# EAGLE design Clock-v16 (EAGLE 5.10)
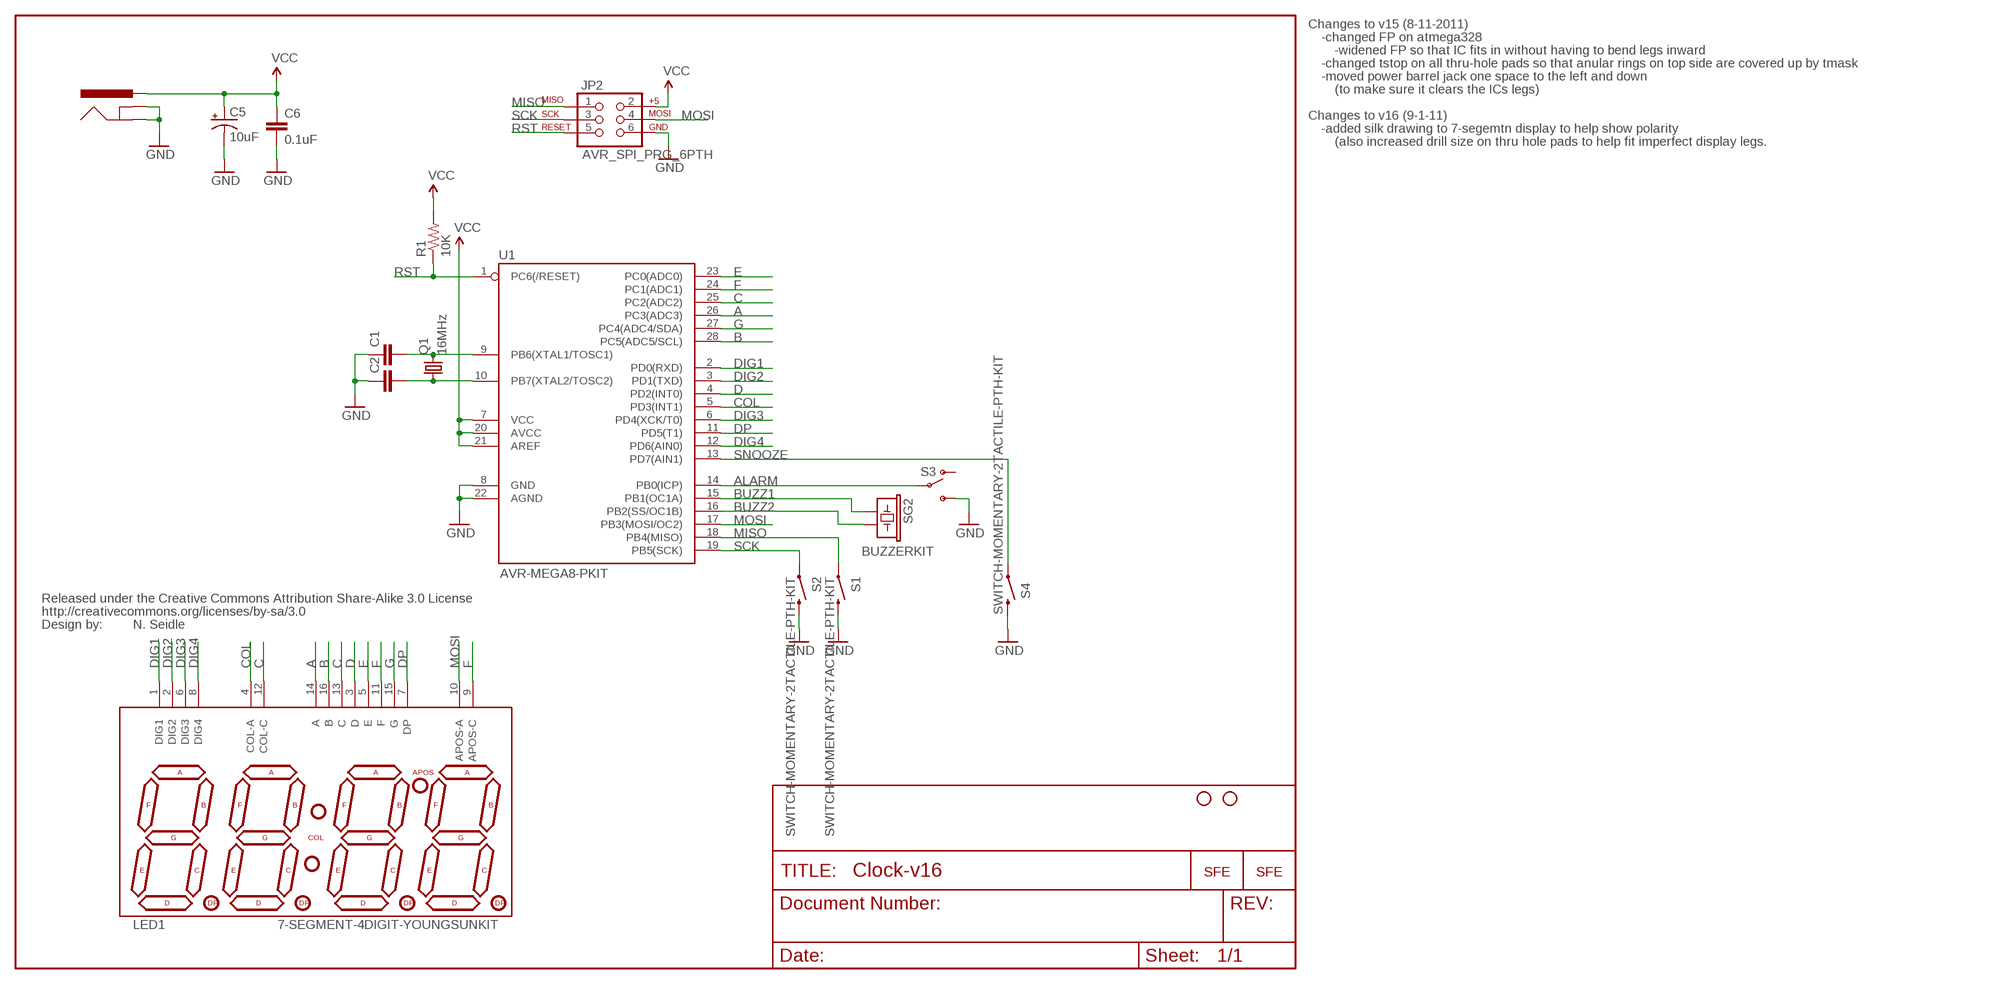
[diagram p0: schematic, sheet 1]

## Parts
C1  CAPCAP-PTH-SMALL-KIT  [CAP-PTH-SMALL-KIT]
C2  CAPCAP-PTH-SMALL-KIT  [CAP-PTH-SMALL-KIT]
C5  10uF  CAP_POLCPOL-RADIAL-10UF-25V-KIT  [CPOL-RADIAL-10UF-25V-KIT]
C6  0.1uF  CAPCAP-PTH-SMALL-KIT  [CAP-PTH-SMALL-KIT]
J1  POWER_JACKKIT  [POWER-BARRELJACK-PTH-LOCK-KIT]
JP2  AVR_SPI_PRG_6PTH  [2X3]
LED1  7-SEGMENT-4DIGIT-YOUNGSUNKIT  [7-SEGMENT-4DIGIT-YOUNGSUN-KIT]
Q1  16MHz  CRYSTALHC49US-KIT  [HC49US-KIT]
R1  10K  RESISTORAXIAL-0.3-KIT  [AXIAL-0.3-KIT]
S1  SWITCH-MOMENTARY-2TACTILE-PTH-KIT  [TACTILE-PTH-KIT]
S2  SWITCH-MOMENTARY-2TACTILE-PTH-KIT  [TACTILE-PTH-KIT]
S3  SWITCH-SPSTKIT  [SWITCH-SPDT_KIT]
S4  SWITCH-MOMENTARY-2TACTILE-PTH-KIT  [TACTILE-PTH-KIT]
SG2  BUZZERKIT  [BUZZER-12MM-KIT]
U1  AVR-MEGA8-PKIT  [DIL28-3-KIT]
U$1  LOGO-SFESK  [SFE-LOGO-FLAME]
U$2  CREATIVE_COMMONS  [CREATIVE_COMMONS]
U$3  LOGO-SFENEW  [SFE-NEW-WEBLOGO]
U$8  STAND-OFF  [STAND-OFF]
U$9  STAND-OFF  [STAND-OFF]

## Nets
A: LED1.14(A) U1.26(PC3(ADC3))
ALARM: S3.2(P) U1.14(PB0(ICP))
B: LED1.16(B) U1.28(PC5(ADC5/SCL))
BUZZ1: SG2.+ U1.15(PB1(OC1A))
BUZZ2: SG2.- U1.16(PB2(SS/OC1B))
C: LED1.12(COL-C) LED1.13(C) U1.25(PC2(ADC2))
COL: LED1.4(COL-A) U1.5(PD3(INT1))
D: LED1.3(D) U1.4(PD2(INT0))
DIG1: LED1.1(DIG1) U1.2(PD0(RXD))
DIG2: LED1.2(DIG2) U1.3(PD1(TXD))
DIG3: LED1.6(DIG3) U1.6(PD4(XCK/T0))
DIG4: LED1.8(DIG4) U1.12(PD6(AIN0))
DP: LED1.7(DP) U1.11(PD5(T1))
E: LED1.5(E) U1.23(PC0(ADC0))
F: LED1.9(APOS-C) LED1.11(F) U1.24(PC1(ADC1))
G: LED1.15(G) U1.27(PC4(ADC4/SDA))
GND: C1.1 C2.1 C5.2(-) C6.2 J1.GND J1.GNDBREAK JP2.6 S1.3 S2.3 S3.3(S) S4.3 U1.8(GND) U1.22(AGND)
MISO: JP2.1 S1.1 U1.18(PB4(MISO))
MOSI: JP2.4 LED1.10(APOS-A) U1.17(PB3(MOSI/OC2))
N$1: C1.2 Q1.2 U1.9(PB6(XTAL1/TOSC1))
N$2: C2.2 Q1.1 U1.10(PB7(XTAL2/TOSC2))
RST: JP2.5 R1.P$1 U1.1(PC6(/RESET))
SCK: JP2.3 S2.1 U1.19(PB5(SCK))
SNOOZE: S4.1 U1.13(PD7(AIN1))
VCC: C5.1(+) C6.1 J1.PWR JP2.2 R1.P$2 U1.7(VCC) U1.20(AVCC) U1.21(AREF)
Unconnected: S3.1(O)

## Notes on the sheet
- Changes to v15 (8-11-2011)
- -changed FP on atmega328
- -widened FP so that IC fits in without having to bend legs inward
- -changed tstop on all thru-hole pads so that anular rings on top side are covered up by tmask
- -moved power barrel jack one space to the left and down
- (to make sure it clears the ICs legs)
- Changes to v16 (9-1-11)
- -added silk drawing to 7-segemtn display to help show polarity
- (also increased drill size on thru hole pads to help fit imperfect display legs.
- N. Seidle

## Library data of the parts
C1 C2 C6 = SparkFun:CAP: Capacitor Standard 0603 ceramic capacitor, and 0.1" leaded capacitor.
C5 = Testing:CAP_POL: Capacitor Polarized These are standard SMD and PTH capacitors. Normally 10uF, 47uF, and 100uF in electrolytic and tantalum varieties. Always verify the external diameter of the through hole cap, it varies with capacity, voltage, and manufacturer. The EIA devices should be standard.
J1 = Testing:POWER_JACK: Power Jack This is the standard 5.5mm barrel jack for power. The PTH is the most common, proven, reliable, footprint. All others are experimental. The Slot footprint only works if the mill layer is transmitted to the PCB fab house so be warned. Spark Fun Electronics SKU : PRT-00119. Mating wall wart : TOL-00298 (and others)
JP2 = SparkFun:AVR_SPI_PRG_6: AVR ISP 6 Pin This is the reduced ISP connector for AVR programming. Common on Arduino. This footprint will take up less PCB space and can be used with a 10-pin to 6-pin adapter such as SKU: BOB-08508
LED1 = Testing:7-SEGMENT-4DIGIT-YOUNGSUN: This is a part for the 4-Digit 7-segment LEDs from Young Sun. Different from the Digikey LEDs, all 16 pins are used. The LONGPADS Variant is used for a test jig, but you may like it because there is more pad to solder to. If you are concerned about routing space, the standard works just fine though.
Q1 = Testing:CRYSTAL: Crystals Various standard crystals. Proven footprints. Spark Fun Electronics SKU : COM-00534
R1 = SparkFun:RESISTOR: Resistor Basic schematic elements and footprints for 0603, 1206, and PTH resistors.
S1 S2 S4 = Testing:SWITCH-MOMENTARY-2
S3 = SparkFun:SWITCH-SPST: SPST Switch Simple slide switch. Spark Fun Electronics SKU : COM-00102
SG2 = SparkFun:BUZZER: Buzzer 12mm Spark Fun Electronics SKU : Comp-Buzzer
U1 = Testing:AVR-MEGA8-P: MICROCONTROLLER 8 Kbytes FLASH 1 kbytes SRAM 512 bytes EEPROM USART 4-channel 10 bit ADC 2-channel 8 bit ADC
U$1 U$3 = SparkFun:LOGO-SFE: Spark Fun Electronics PCB Logo This is the standard Spark Fun Electronics PCB logo.
U$2 = SparkFun:CREATIVE_COMMONS
U$8 U$9 = SparkFun:STAND-OFF: Stand Off This is the mechanical footprint for a #4 phillips button head screw. Use the keepout ring to avoid running the screw head into surrounding components. SKU : PRT-00447

## Board
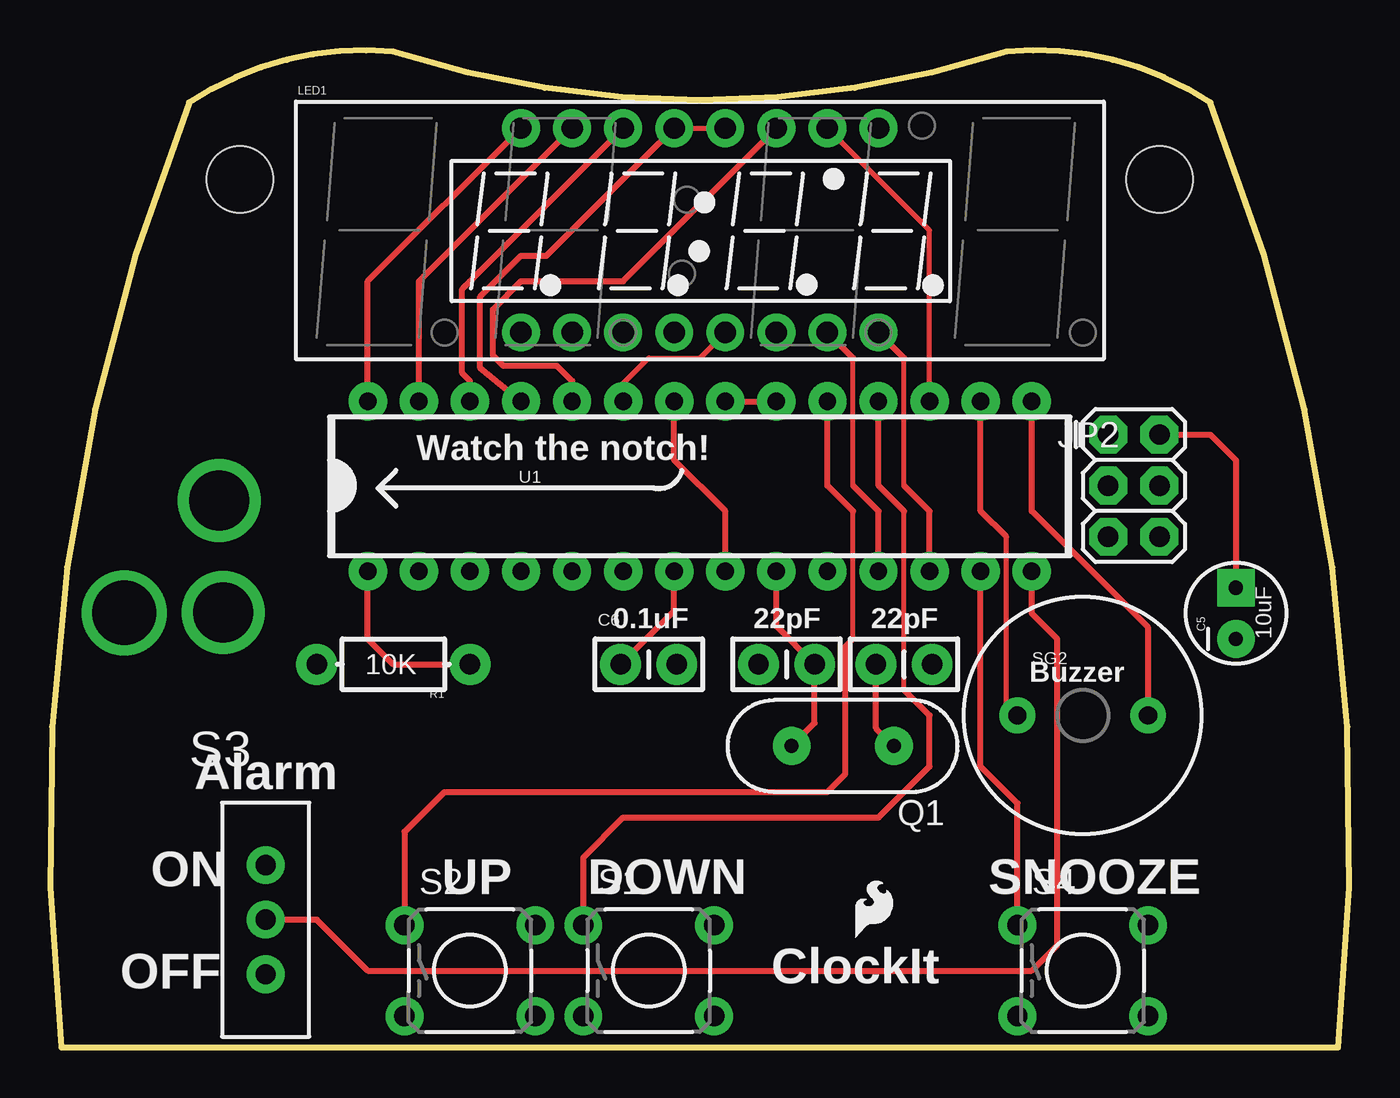
[diagram p1: board, top side]
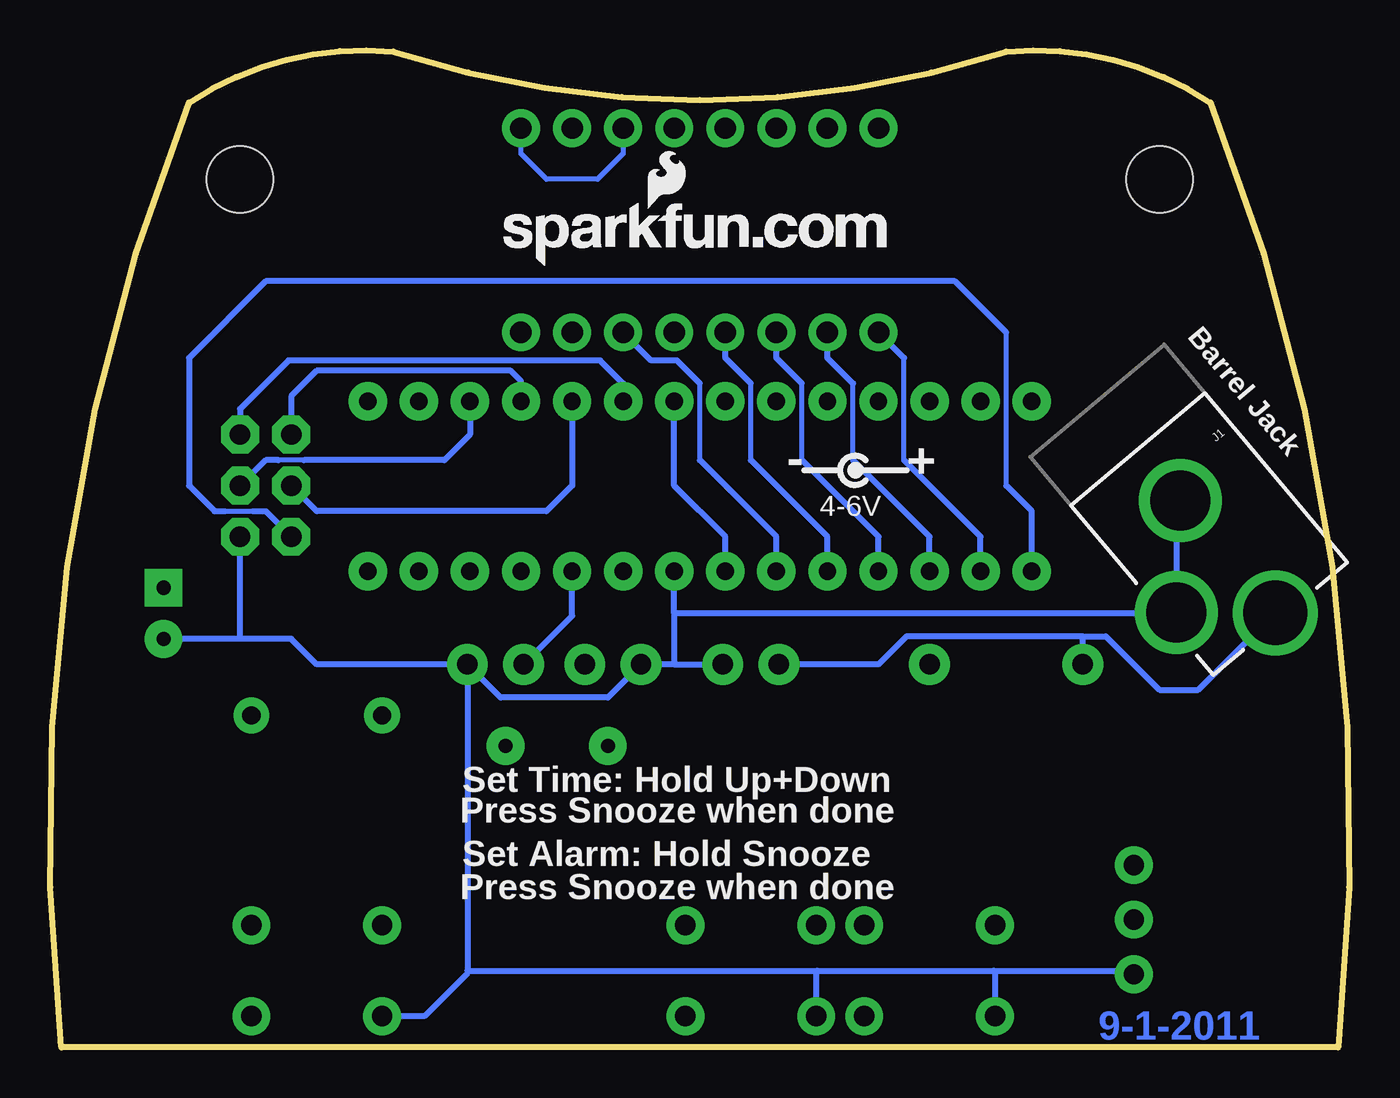
[diagram p2: board, bottom side, seen from below]

Size 64.61 x 49.6 mm. Coordinates in mm from the lower left corner, seen from the top.
Outline: 6.9,46.99 arc28 0.55,0 64.05,0 arc28 57.7,46.99 arc38 47.54,49.53 arc-36 17.06,49.53 arc39 6.9,46.99
Copper layers (1*16): Top 0.035mm / dielectric 1.5mm / Bottom 0.035mm
Design rules "SparkFun": minimum track width 8mil, minimum drill 20mil, track to track 8mil, track to pad 8mil, pad to pad 8mil, via to via 8mil, smd to smd 8mil, copper to edge 10mil, drill to drill 8mil, minimum pad ring 12mil, minimum via ring 10mil, stop-mask expansion 4mil, vias tented up to drill 25mil, thermal gap 10mil

### Footprints (pad centres in the part's own frame; a part is rotated, then mirrored left to right if it is on the bottom)
CAP-PTH-SMALL-KIT = drill 1.016 pad 2.032 round: 1 -0.127,0; 2 2.667,0
CPOL-RADIAL-10UF-25V-KIT = drill 0.7 pad 1.88 square: 1 1.27,0 | drill 0.7 pad 1.88 round: 2 -1.27,0
POWER-BARRELJACK-PTH-LOCK-KIT = drill 2.997 pad 4.115 round: GND 0.025,6.557; GNDBREAK 3.762,10.7 | drill 3.2 pad 4.115 round: PWR 0,13.878
2X3 = drill 1.016 pad 1.88 octagon: 1 0,0; 2 0,2.54; 3 2.54,0; 4 2.54,2.54; 5 5.08,0; 6 5.08,2.54
7-SEGMENT-4DIGIT-YOUNGSUN-KIT = drill 1.067 pad 1.88 round: 1 -8.89,-5.08; 2 -6.35,-5.08; 3 -3.81,-5.08; 4 -1.27,-5.08; 5 1.27,-5.08; 6 3.81,-5.08; 7 6.35,-5.08; 8 8.89,-5.08; 9 8.89,5.08; 10 6.35,5.08; 11 3.81,5.08; 12 1.27,5.08; 13 -1.27,5.08; 14 -3.81,5.08; 15 -6.35,5.08; 16 -8.89,5.08
HC49US-KIT = drill 0.7 pad 1.88 round: 1 -2.54,0; 2 2.54,0
AXIAL-0.3-KIT = drill 1.016 pad 2.032 round: P$1 -3.81,0; P$2 3.81,0
TACTILE-PTH-KIT = drill 1.016 pad 1.88 round: 1 -3.251,2.261; 2 3.251,2.261; 3 -3.251,-2.261; 4 3.251,-2.261
SWITCH-SPDT_KIT = drill 1.016 pad 1.88 round: 1 0,2.718; 2 0,0; 3 0,-2.718
BUZZER-12MM-KIT = drill 0.9 pad 1.778 round: + 3.25,0; - -3.25,0
DIL28-3-KIT = drill 0.864 pad 1.905 round: 1 -16.51,-4.255; 2 -13.97,-4.255; 3 -11.43,-4.255; 4 -8.89,-4.255; 5 -6.35,-4.255; 6 -3.81,-4.255; 7 -1.27,-4.255; 8 1.27,-4.255; 9 3.81,-4.255; 10 6.35,-4.255; 11 8.89,-4.255; 12 11.43,-4.255; 13 13.97,-4.255; 14 16.51,-4.255; 15 16.51,4.191; 16 13.97,4.191; 17 11.43,4.191; 18 8.89,4.191; 19 6.35,4.191; 20 3.81,4.191; 21 1.27,4.191; 22 -1.27,4.191; 23 -3.81,4.191; 24 -6.35,4.191; 25 -8.89,4.191; 26 -11.43,4.191; 27 -13.97,4.191; 28 -16.51,4.191
STAND-OFF = hole 3.302: 0,0

### Placement (x,y rotation side)
C1  35.35,19.05 0 top
C2  43.73,19.05 180 top
C5  58.97,21.59 90 top
C6  28.49,19.05 0 top
J1  12.6,32.24 220 bottom
JP2  52.62,30.48 270 top
LED1  32.3,40.64 0 top
Q1  39.41,14.99 180 top
R1  17.06,19.05 180 top
S1  29.76,3.81 0 top
S2  20.87,3.81 0 top
S3  10.71,6.35 0 top
S4  51.35,3.81 0 top
SG2  51.35,16.51 0 top
U1  32.3,27.94 0 top
U$1  40.05,5.46 0 top
U$2  -0.72,-8.89 0 top  (outside the outline)
U$3  42.08,38.86 0 bottom
U$8  9.44,43.18 0 top
U$9  55.16,43.18 0 top

### Tracks (layer width: path | path; a pad name or v marks a point on that pad's centre or on a via)
A
  Top 0.305: U1.26 20.87,33.15 20.49,33.53 20.49,37.72 LED1.14
ALARM
  Top 0.305: S3.2 13.25,6.35 15.79,3.81 48.81,3.81 50.08,5.08 50.08,20.32 48.81,21.59 U1.14
B
  Top 0.305: U1.28 15.79,38.1 LED1.16
BUZZ1
  Top 0.305: U1.15 48.81,26.67 54.6,20.88 SG2.+
BUZZ2
  Top 0.254: 47.54,17.07 47.54,25.4
  Top 0.305: U1.16 46.27,26.67 47.54,25.4 | SG2.- 47.54,17.07
C
  Top 0.254: LED1.13 LED1.12
  Top 0.305: LED1.13 24.68,39.37 23.41,39.37 21.38,37.34 21.38,33.78 U1.25
COL
  Bottom 0.254: 29.76,29.21 29.76,33.02
  Bottom 0.305: U1.5 25.95,25.4 29.76,29.21 | 29.76,33.02 31.03,34.29 LED1.4
D
  Bottom 0.254: 27.22,29.21 27.22,33.02
  Bottom 0.305: U1.4 23.41,25.4 27.22,29.21 | 27.22,33.02 28.49,34.29 LED1.3
DIG1
  Bottom 0.254: 22.14,29.21 22.14,34.29
  Bottom 0.305: U1.2 18.33,25.4 22.14,29.21 | 22.14,34.29 LED1.1
DIG2
  Bottom 0.254: 24.68,29.21 24.68,33.02
  Bottom 0.305: U1.3 20.87,25.4 24.68,29.21 | 24.68,33.02 25.95,34.29 LED1.2
DIG3
  Bottom 0.254: 32.3,29.21 32.3,33.02
  Bottom 0.305: U1.6 28.49,25.4 32.3,29.21 | 32.3,33.02 33.45,34.16 34.72,34.16 LED1.6
DIG4
  Top 0.254: 42.46,27.94 42.46,34.29
  Top 0.305: U1.12 43.73,26.67 42.46,27.94 | 42.46,34.29 LED1.8
DP
  Top 0.254: 39.92,27.94 39.92,34.29
  Top 0.305: U1.11 41.19,26.67 39.92,27.94 | 39.92,34.29 LED1.7
E
  Top 0.254: U1.23 28.49,33.02 29.76,34.29 32.3,34.29 LED1.5
F
  Top 0.305: LED1.11 28.49,38.1 23.41,38.1 22.02,36.7 22.02,34.42 22.52,33.91 25.19,33.91 25.95,33.15 U1.24
  Bottom 0.254: LED1.11 36.11,44.45 37.38,43.18 39.92,43.18 41.19,44.45 LED1.9
G
  Top 0.305: U1.27 18.33,38.1 LED1.15
GND
  Top 0.305: U1.22 31.03,29.21 33.57,26.67 U1.8
  Bottom 0.305: S4.3 45.99,1.55 43.86,3.68 43.86,3.81 | 26.46,3.81 17.7,3.81 | S1.3 26.51,3.76 26.46,3.81 | S2.3 17.62,3.73 17.7,3.81 | 33.57,21.59 U1.8 | 33.57,19.05 C1.1 36.87,17.4 42.21,17.4 C2.1 | 33.57,19.05 C6.2 | 55.16,20.32 52.62,20.32 51.35,19.05 C2.1 | 55.16,20.32 C5.2 | 55.16,20.32 JP2.6 | 33.57,21.59 33.57,19.05 | 17.7,3.81 10.89,3.81 S3.3 | C2.1 43.86,3.81 | 43.86,3.81 26.46,3.81 | 33.57,21.59 8.64,21.59 J1.GNDBREAK 8.6,27 J1.GND
MISO
  Top 0.254: 42.46,17.78 42.46,26.67
  Top 0.305: U1.18 41.19,27.94 42.46,26.67 | S1.1 26.51,9.45 28.49,11.43 41.19,11.43 43.73,13.97 43.73,16.51 42.46,17.78
  Bottom 0.305: JP2.1 52.62,32.38 51.35,33.66 41.7,33.66 41.19,33.15 U1.18
MOSI
  Top 0.254: LED1.10 43.73,40.64 U1.17
  Bottom 0.254: 51.99,29.21 53.26,29.21
  Bottom 0.305: U1.17 43.73,30.48 45,29.21 51.99,29.21 | JP2.4 53.89,29.21 53.26,29.21
N$1
  Top 0.305: Q1.2 38.02,16.13 C1.2 36.11,20.95 U1.9
N$2
  Top 0.305: C2.2 41.07,15.88 Q1.1
  Bottom 0.305: U1.10 38.65,21.46 C2.2
RST
  Top 0.305: U1.1 15.79,20.32 17.06,19.05 R1.P$1
  Bottom 0.254: 17.06,27.94 17.06,35.56 | 55.92,26.67 54.53,26.67
  Bottom 0.305: 17.06,35.56 19.6,38.1 53.89,38.1 57.7,34.29 57.7,27.94 56.43,26.67 55.92,26.67 | 17.06,27.94 15.79,26.67 U1.1 | JP2.5 53.89,26.67 54.53,26.67
SCK
  Top 0.254: 39.92,20.32 39.92,26.67
  Top 0.305: U1.19 38.65,27.94 39.92,26.67 | S2.1 17.62,10.72 19.6,12.7 38.65,12.7 39.54,13.59 39.54,19.94 39.92,20.32
  Bottom 0.305: U1.19 38.65,27.94 39.92,26.67 51.35,26.67 JP2.3
SNOOZE
  Top 0.305: S4.1 48.1,12.14 46.27,13.97 U1.13
VCC
  Top 0.305: U1.21 U1.20 | C5.1 58.97,29.21 57.7,30.48 JP2.2 | U1.7 31.03,21.72 C6.1
  Bottom 0.305: U1.7 31.03,25.4 33.57,27.94 U1.21 | C6.1 23.41,19.05 22.02,20.45 13.25,20.45 | R1.P$2 13.25,20.45 | U1.20 36.11,33.02 37.26,34.16 52.75,34.16 55.16,31.75 JP2.2 | 13.25,20.45 12.11,20.45 9.44,17.78 7.51,17.78 J1.PWR

### Text on the board
Bottom: 9-1-2011
tPlace: Watch the notch! | 0.1uF | 22pF | 22pF | Buzzer | Alarm | ON | UP | DOWN | SNOOZE | OFF | ClockIt
bPlace: Barrel Jack | + | - | 4-6V | Set Time: Hold Up+Down | Press Snooze when done | Set Alarm: Hold Snooze | Press Snooze when done
tValues: Power Jack | On Back